# EAGLE design Grove - Vibrator Motor v1.2 (EAGLE 6.3)
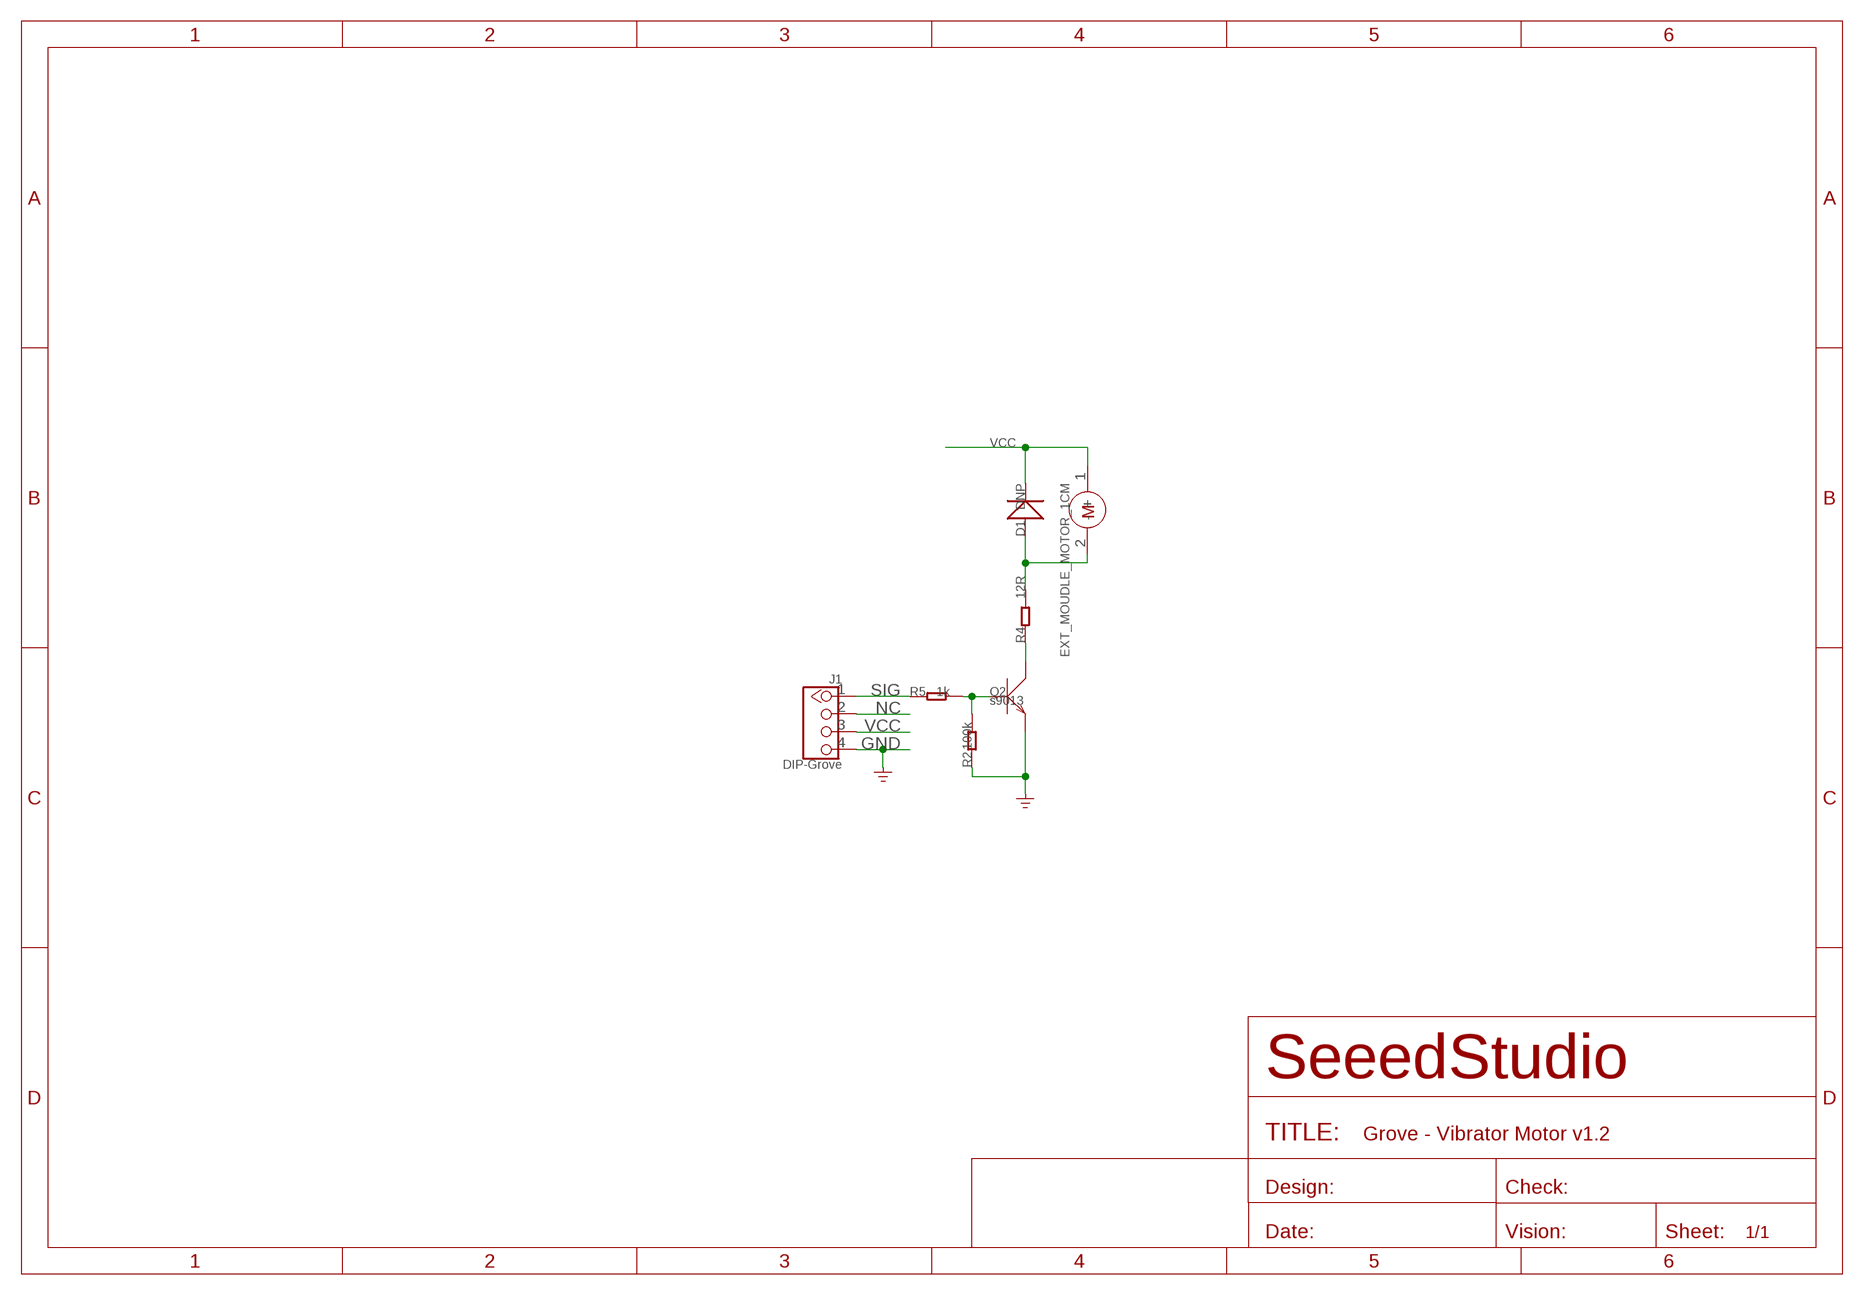
[diagram p0: schematic, sheet 1]

## Parts
D1  DNP  D'1206'  [SOD123]
J1  DIP-Grove  TWIG_2.0-DIP-FEMALE  [2.0_1X4]
M1  EXT_MOUDLE_MOTOR_1CM  [EXT_MOUDLE_MOTOR_1CM]
Q2  s9013  TRANSISTOR-NPN-SOT23  [SOT23]
R2  100k  R-0603  [R0603]
R4  12R  R-0603  [R0603]
R5  1k  R-0603  [R0603]

## Nets
GND: J1.4 Q2.2(E) R2.1
N$1: D1.+ M1.2(-) R4.2
N$5: Q2.3(C) R4.1
N$17: Q2.1(B) R2.2 R5.2
NC: J1.2
SIG: J1.1 R5.1
VCC: D1.- J1.3 M1.1(+)

## Library data of the parts
D1 = Discrete:D*
J1 = Connector:TWIG_2.0-DIP-FEMALE
M1 = template:EXT_MOUDLE_MOTOR_1CM
Q2 = Discrete:TRANSISTOR-NPN*: NPN audion
R2 R4 R5 = Discrete:R*

## Board
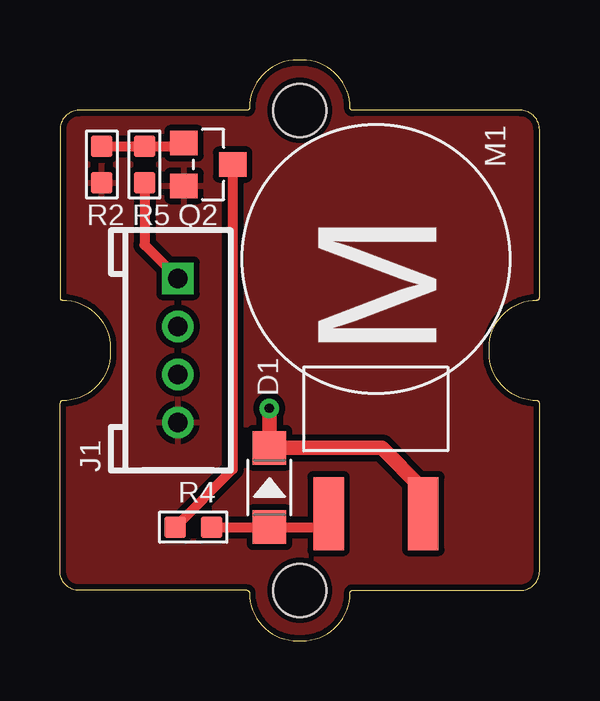
[diagram p1: board, top side]
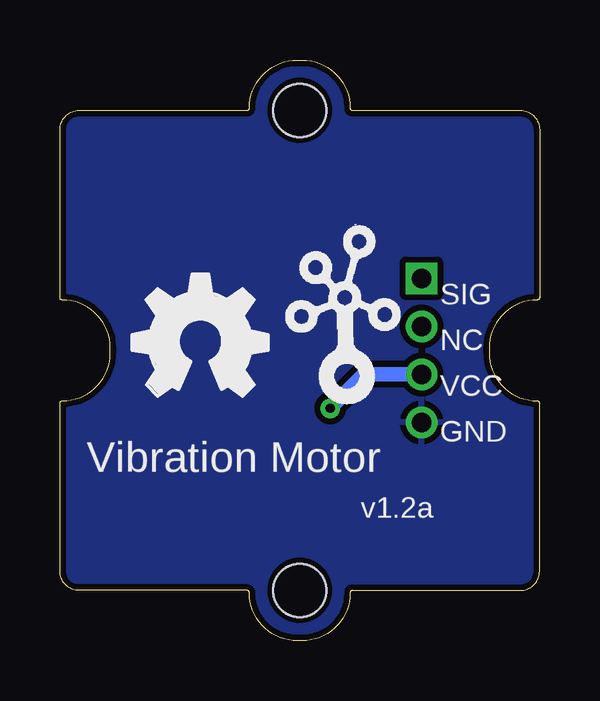
[diagram p2: board, bottom side, seen from below]

Size 20 x 24.2 mm. Coordinates in mm from the lower left corner, seen from the top.
Copper layers (1*16): Top 0.035mm / dielectric 1.5mm / Bottom 0.035mm
Design rules "SeeedStudio_rule_no_angle_090911 *": minimum track width 6mil, minimum drill 12mil, track to track 6mil, track to pad 6mil, pad to pad 6mil, via to via 6mil, smd to smd 0mil, copper to edge 10mil, drill to drill 10mil, minimum pad ring 10mil, minimum via ring 6mil, stop-mask expansion 2mil, vias tented up to drill 100mil, thermal gap 10mil

### Footprints (pad centres in the part's own frame; a part is rotated, then mirrored left to right if it is on the bottom)
SOD123 = smd 1.397 x 1.397: + -1.651,0; - 1.651,0
2.0_1X4 = drill 0.8 pad 1.27 square: 1 -3,0 | drill 0.8 pad 1.27: 2 -1,0; 3 1,0; 4 3,0
EXT_MOUDLE_MOTOR_1CM = smd 3.048 x 1.27: 1 10.613,1.976; 2 10.613,-1.976
SOT23 = smd 1.016 x 1.143: 1 -0.889,-1.016; 2 0.889,-1.016; 3 0,1.016
R0603 = smd 0.889 x 0.889: 1 -0.762,0; 2 0.762,0
1U-DIM-W/-DRILL = hole 2.2: 0,-10; 0,10

### Placement (x,y rotation side)
D1  8.73,6.38 90 top
J1  4.92,12.1 270 top
M1  13.18,15.91 270 top
Q2  6.19,19.85 270 top
R2  1.74,19.85 90 top
R4  5.55,4.73 0 top
R5  3.52,19.85 90 top
U$2  [OSHW_FILLX200_NOTEXT]  16.98,10.2 0 bottom
U$5  [1U-DIM-W/-DRILL]  10,12.1 180 top
U$6  [TWIGLOGO]  8.1,10.83 0 bottom

### Tracks (layer width: path | path; a pad name or v marks a point on that pad's centre or on a via)
GND
  pour Top (isolate 0.254): -0.16,0.04 20.16,0.04 20.16,24.16 -0.16,24.16 -0.16,0.16
  pour Bottom (isolate 0.254): -0.16,0.04 20.16,0.04 20.16,24.16 -0.16,24.16 -0.16,0.16
N$1
  Top 0.406: R4.2 D1.+ 11.27,4.73 11.27,5.23 M1.2
N$5
  Top 0.406: Q2.3 7.21,7.15 R4.1
N$17
  Top 0.406: R2.2 R5.2 5.05,20.61 Q2.1
SIG
  Top 0.406: R5.1 3.52,16.5 J1.1
VCC  (via drill 0.38 pad 0.81)
  Top 0.61: v8.73,9.69 D1.- 13.43,8.04 15.08,6.38 15.08,5.37 M1.1
  Bottom 0.61: J1.3 7.32,11.1 v8.73,9.69

### Text on the board
bPlace: SIG | NC | VCC | GND | Vibration Motor | v1.2a